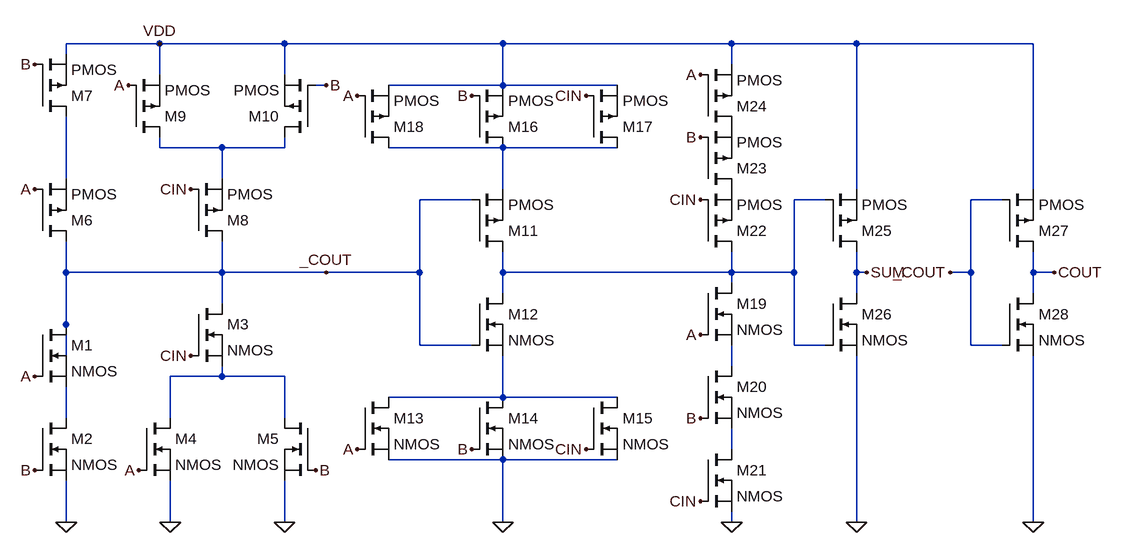
[diagram p0: schematic FA version2.asc]
FA version2.asc, the LTspice schematic file:
Version 4
SHEET 1 1760 680
WIRE -240 -288 -384 -288
WIRE -48 -288 -240 -288
WIRE 288 -288 -48 -288
WIRE 640 -288 288 -288
WIRE 832 -288 640 -288
WIRE 1104 -288 832 -288
WIRE -384 -272 -384 -288
WIRE 640 -256 640 -288
WIRE -240 -240 -240 -288
WIRE -48 -240 -48 -288
WIRE 16 -224 0 -224
WIRE 288 -224 288 -288
WIRE 288 -224 112 -224
WIRE 464 -224 288 -224
WIRE -240 -128 -240 -144
WIRE -144 -128 -240 -128
WIRE -48 -128 -48 -144
WIRE -48 -128 -144 -128
WIRE 288 -128 112 -128
WIRE 464 -128 288 -128
WIRE -384 -80 -384 -176
WIRE -144 -80 -144 -128
WIRE 288 -64 288 -128
WIRE 832 -64 832 -288
WIRE 1104 -64 1104 -288
WIRE 240 -48 160 -48
WIRE 784 -48 736 -48
WIRE 1056 -48 1008 -48
WIRE -384 64 -384 16
WIRE -144 64 -144 16
WIRE -144 64 -384 64
WIRE 16 64 -144 64
WIRE 160 64 160 -48
WIRE 160 64 16 64
WIRE 288 64 288 32
WIRE 640 64 640 32
WIRE 640 64 288 64
WIRE 736 64 736 -48
WIRE 736 64 640 64
WIRE 832 64 832 32
WIRE 848 64 832 64
WIRE 1008 64 1008 -48
WIRE 1008 64 976 64
WIRE 1104 64 1104 32
WIRE 1136 64 1104 64
WIRE 640 80 640 64
WIRE 288 96 288 64
WIRE 832 96 832 64
WIRE 1104 96 1104 64
WIRE -144 112 -144 64
WIRE -384 144 -384 64
WIRE 160 176 160 64
WIRE 240 176 160 176
WIRE 736 176 736 64
WIRE 784 176 736 176
WIRE 1008 176 1008 64
WIRE 1056 176 1008 176
WIRE -384 192 -384 144
WIRE 640 208 640 176
WIRE -144 224 -144 208
WIRE -144 224 -224 224
WIRE -48 224 -144 224
WIRE 288 256 288 192
WIRE 288 256 112 256
WIRE 464 256 288 256
WIRE -384 288 -384 240
WIRE -224 288 -224 224
WIRE -48 288 -48 224
WIRE 640 336 640 304
WIRE 288 352 112 352
WIRE 464 352 288 352
WIRE -384 448 -384 384
WIRE -224 448 -224 384
WIRE -48 448 -48 384
WIRE 288 448 288 352
WIRE 640 448 640 432
WIRE 832 448 832 192
WIRE 1104 448 1104 192
FLAG -384 448 0
FLAG -224 448 0
FLAG -48 448 0
FLAG -432 224 A
FLAG -272 368 A
FLAG -432 368 B
FLAG 0 368 B
FLAG -192 192 CIN
FLAG -240 -288 VDD
FLAG -432 -64 A
FLAG -288 -224 A
FLAG -432 -256 B
FLAG 16 -224 B
FLAG -192 -64 CIN
FLAG 288 448 0
FLAG 64 -208 A
FLAG 64 336 A
FLAG 240 -208 B
FLAG 240 336 B
FLAG 416 -208 CIN
FLAG 416 336 CIN
FLAG 16 64 _COUT
FLAG 640 448 0
FLAG 592 -240 A
FLAG 592 160 A
FLAG 592 -144 B
FLAG 592 -48 CIN
FLAG 592 288 B
FLAG 592 416 CIN
FLAG 832 448 0
FLAG 848 64 SUM
FLAG 1136 64 COUT
FLAG 1104 448 0
FLAG 976 64 _COUT
SYMBOL nmos -432 144 R0
SYMATTR InstName M1
SYMBOL nmos -432 288 R0
SYMATTR InstName M2
SYMBOL nmos -192 112 R0
SYMATTR InstName M3
SYMBOL nmos -272 288 R0
SYMATTR InstName M4
SYMBOL nmos 0 288 M0
SYMATTR InstName M5
SYMBOL pmos -432 16 M180
SYMATTR InstName M6
SYMBOL pmos -432 -176 M180
SYMATTR InstName M7
SYMBOL pmos -192 16 M180
SYMATTR InstName M8
SYMBOL pmos -288 -144 M180
SYMATTR InstName M9
SYMBOL pmos 0 -144 R180
SYMATTR InstName M10
SYMBOL pmos 240 32 M180
SYMATTR InstName M11
SYMBOL nmos 240 96 R0
SYMATTR InstName M12
SYMBOL nmos 64 256 R0
SYMATTR InstName M13
SYMBOL nmos 240 256 R0
SYMATTR InstName M14
SYMBOL nmos 416 256 R0
SYMATTR InstName M15
SYMBOL pmos 240 -128 M180
SYMATTR InstName M16
SYMBOL pmos 416 -128 M180
SYMATTR InstName M17
SYMBOL pmos 64 -128 M180
SYMATTR InstName M18
SYMBOL nmos 592 80 R0
SYMATTR InstName M19
SYMBOL nmos 592 208 R0
SYMATTR InstName M20
SYMBOL nmos 592 336 R0
SYMATTR InstName M21
SYMBOL pmos 592 32 M180
SYMATTR InstName M22
SYMBOL pmos 592 -64 M180
SYMATTR InstName M23
SYMBOL pmos 592 -160 M180
SYMATTR InstName M24
SYMBOL pmos 784 32 M180
SYMATTR InstName M25
SYMBOL nmos 784 96 R0
SYMATTR InstName M26
SYMBOL pmos 1056 32 M180
SYMATTR InstName M27
SYMBOL nmos 1056 96 R0
SYMATTR InstName M28

The netlist it stands for:
* FA version2.asc
M1 _COUT A N008 N008 NMOS
M2 N008 B 0 0 NMOS
M3 _COUT CIN N006 N006 NMOS
M4 N006 A 0 0 NMOS
M5 N006 B 0 0 NMOS
M6 _COUT A N003 N003 PMOS
M7 N003 B VDD VDD PMOS
M8 _COUT CIN N001 N001 PMOS
M9 N001 A VDD VDD PMOS
M10 N001 B VDD VDD PMOS
M11 N004 _COUT N002 N002 PMOS
M12 N004 _COUT N007 N007 NMOS
M13 N007 A 0 0 NMOS
M14 N007 B 0 0 NMOS
M15 N007 CIN 0 0 NMOS
M16 N002 B VDD VDD PMOS
M17 N002 CIN VDD VDD PMOS
M18 N002 A VDD VDD PMOS
M19 N004 A N005 N005 NMOS
M20 N005 B N009 N009 NMOS
M21 N009 CIN 0 0 NMOS
M22 N004 CIN P001 P001 PMOS
M23 P001 B P002 P002 PMOS
M24 P002 A VDD VDD PMOS
M25 SUM N004 VDD VDD PMOS
M26 SUM N004 0 0 NMOS
M27 COUT _COUT VDD VDD PMOS
M28 COUT _COUT 0 0 NMOS
.model NMOS NMOS
.model PMOS PMOS
.lib standard.mos
.backanno
.end